# Altium schematic sheet 5V Switching Reg.SchDoc
size A4; SheetNumber: 4; SheetTotal: 6
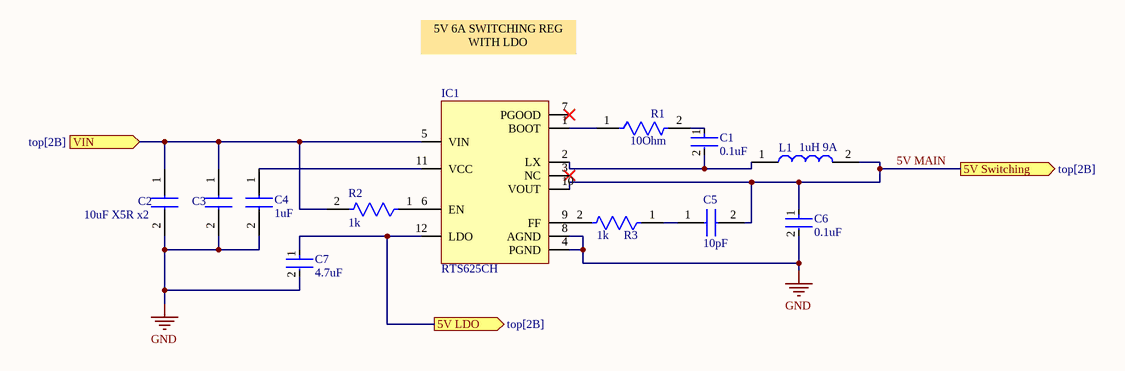
[diagram p0: 5V Switching Reg.SchDoc]

## Parts
C1  0.1uF  [FP-C0603C-CF-MFG]
C2  10uF X5R x2  [CAPC1608X90N]
C3  10uF X5R  [CAPC1608X90N]  (value not drawn)
C4  1uF  [CAPC1608X90N]
C5  10pF  [CAPC1608X95N]
C6  0.1uF  [FP-C0603C-CF-MFG]
C7  4.7uF  [FP-CL10-IPC_C]
IC1  RTS625CH  [RT6258C]
L1  1uH 9A  [IFDC3030EZER1R0N]
R1  10Ohm  [FP-CRCW0603-C-MFG]
R2  1k  [FP-RC0603-0_55-IPC_C]
R3  1k  [FP-RC0603-0_55-IPC_C]

## Ports
5V LDO (out, see top[2B]), 5V Switching (out, see top[2B]), VIN (in, see top[2B])

## Nets
GND: C2.2 C3.2 C4.2 C6.2 C7.2 IC1.4(PGND) IC1.8(AGND)
5V LDO: C7.1 IC1.12(LDO) ; port 5V LDO
5V MAIN: C5.2 C6.1 IC1.10(VOUT) L1.2 ; port 5V Switching
VIN: C2.1 C3.1 IC1.5(VIN) R2.2 ; port VIN
NetC1_1: C1.1 R1.2
NetC1_2: C1.2 IC1.2(LX) L1.1
NetC4_1: C4.1 IC1.11(VCC)
NetC5_1: C5.1 R3.1
NetIC1_1: IC1.1(BOOT) R1.1
NetIC1_6: IC1.6(EN) R2.1
NetIC1_9: IC1.9(FF) R3.2

Not connected (* = marked no-connect by the designer): IC1 3(NC)* 7(PGOOD)*

## Notes on the sheet
- 5V 6A SWITCHING REG WITH LDO

## Library data of the parts
C1 C6 = CMP-2006-03057-2: CAP CER 0.1UF 25V X7R 0603; Manufacturer Part Number: C0603C104K3RACTU; Manufacturer: KEMET; Value: 0.10 μF; Material: Ceramic; Tolerance: 0.1; Temperature Coefficient: 30ppm/°C; Automotive Grade: Grade 1; Lead Free: Yes; Device Class L3: Ceramic Capacitors; Voltage Rating: 25 V; Digikey Description: CAP CER 0.1UF 25V X7R 0603; Mouser Description: Multilayer Ceramic Capacitors MLCC - SMD/SMT 25volts 0.1uF X7R 10%; Package: C0603C-CF; Temperature Range Low: -55°C; Automotive: Yes; Device Class L2: Capacitors; Octopart: https://octopart.com/c0603c104k3ractu-kemet-127541; ComponentLink2Description: Datasheet; ComponentLink2URL: https://api.kemet.com/component-edge/download/datasheet/C0603C100J5GACAUTO.pdf; Temperature Range High: +125°C; RoHS: TRUE; Device Class L1: Passive Components; Category: Cap; Temperature: -55°C to +125°C; Capacitance: 0.10 μF; Height: 0.87mm; Temperature Characteristic: X7R
C2 C3 = CL10A106MA8NRNC: Capacitor; Manufacturer_Name: SAMSUNG; Datasheet Link: https://www.arrow.com/en/products/cl10a106ma8nrnc/samsung-electro-mechanics; Height: 0.9mm; Manufacturer_Part_Number: CL10A106MA8NRNC; Mouser Part Number: 187-CL10A106MA8NRNC; Mouser Price/Stock: https://www.mouser.co.uk/ProductDetail/Samsung-Electro-Mechanics/CL10A106MA8NRNC?qs=47mY1nHWefS2vFRvRJVTdQ%3D%3D; Arrow Part Number: CL10A106MA8NRNC; Arrow Price/Stock: https://www.arrow.com/en/products/cl10a106ma8nrnc/samsung-electro-mechanics?utm_currency=USD&region=nac
C4 = EMK107B7105KA-T: Capacitor; Manufacturer_Name: TAIYO YUDEN; Datasheet Link: https://componentsearchengine.com/Datasheets/1/EMK107B7105KA-T.pdf; Height: 0.9mm; Manufacturer_Part_Number: EMK107B7105KA-T; Mouser Part Number: 963-EMK107B7105KA-T; Mouser Price/Stock: https://www.mouser.co.uk/ProductDetail/TAIYO-YUDEN/EMK107B7105KA-T?qs=I6KAKw0tg2zS1zj87Lm%2FxQ%3D%3D
C5 = 0603N100J500CT: Capacitor; Manufacturer_Name: Walsin Technology Corporation; Datasheet Link: https://datasheet.datasheetarchive.com/originals/distributors/DKDS41/DSANUWW0027552.pdf; Height: 0.95mm; Manufacturer_Part_Number: 0603N100J500CT; Mouser Part Number: 791-0603N100J500CT; Mouser Price/Stock: https://www.mouser.co.uk/ProductDetail/Walsin/0603N100J500CT?qs=t1sE%252BOcWp5sS3BuqSvZ7LQ%3D%3D
C7 = CMP-13271-003017-1: Cap Ceramic 4.7uF 10V X5R ±10% Pad SMD 0603 +85°C T/R; Capacitance: 4.7uF; Case/Package: 0603; Packaging: Tape and Reel; Width: 0.031inch; Contact Plating: Tin; Thickness: 0.035inch; Package Quantity: 1; Voltage Rating: 10V; Case Code (Metric): 1608; Case Code (Imperial): 0603; Depth: 0.8mm; Height: 0.8mm; Tolerance: 10%; Max Operating Temperature: 85°C; Length: 1.6mm; Dielectric: X5R; Mount: Surface Mount; Radiation Hardening: No; Min Operating Temperature: -55°C
IC1 = RTS625CH: 5V6A SWITCHING REG WITH 5V LDO
L1 = IFDC3030EZER1R0N: Inductor; Manufacturer_Name: Vishay; Datasheet Link: https://www.mouser.pl/ProductDetail/Vishay/IFDC3030EZER1R0N?qs=iLKYxzqNS76W2wwIdyJsOA%3D%3D&srsltid=AfmBOoplWxOmL_1KN57dRWQGL9gAV5jJY47jYKvTr8QJ9T9ueMB2OGhk; Height: 5mm; Manufacturer_Part_Number: IFDC3030EZER1R0N; Mouser Part Number: 70-IFDC3030EZER1R0N; Mouser Price/Stock: https://www.mouser.co.uk/ProductDetail/Vishay-Dale/IFDC3030EZER1R0N?qs=iLKYxzqNS76W2wwIdyJsOA%3D%3D
R1 = CMP-02407-011565-1: RES SMD 10 OHM 1% 1/10W 0603; Resistance: 10R; Power Rating: 100mW; Lead Free: Lead Free; Case/Package: 0603; RoHS Compliant: Yes; Tolerance: 1%
R2 R3 = CMP-1659-00009-5: RES 1K OHM 1% 1/10W 0603; Resistance: 1kR; Voltage Rating: 50V; Power Rating: 100mW; Temperature Coefficient: 100ppm/°C; Military Standard: Not; REACH SVHC: No SVHC; Size Code: 0603; Features: Moisture Resistant; Number of Terminations: 2; Technology: THICK FILM; Series: RC; Case Code (Metric): 1608; Resistance Tolerance: 1%; Resistor Type: Thick Film; Termination: SMD/SMT; Contact Plating: Tin; Radiation Hardening: No; Min Operating Temperature: -55°C; Max Operating Temperature: 155°C; Packaging: Tape and Reel; Max Power Dissipation: 100mW; RoHS Compliant: Yes; Height: 0.45mm; Lead Free: Lead Free; Case/Package: 0603; Length: 1.6mm; Tolerance: 1%; Case Code (Imperial): 0603; Construction: Rectangular; Depth: 0.8mm